# EAGLE design synthesizer-RF-Si4123 (EAGLE 9.2.2)
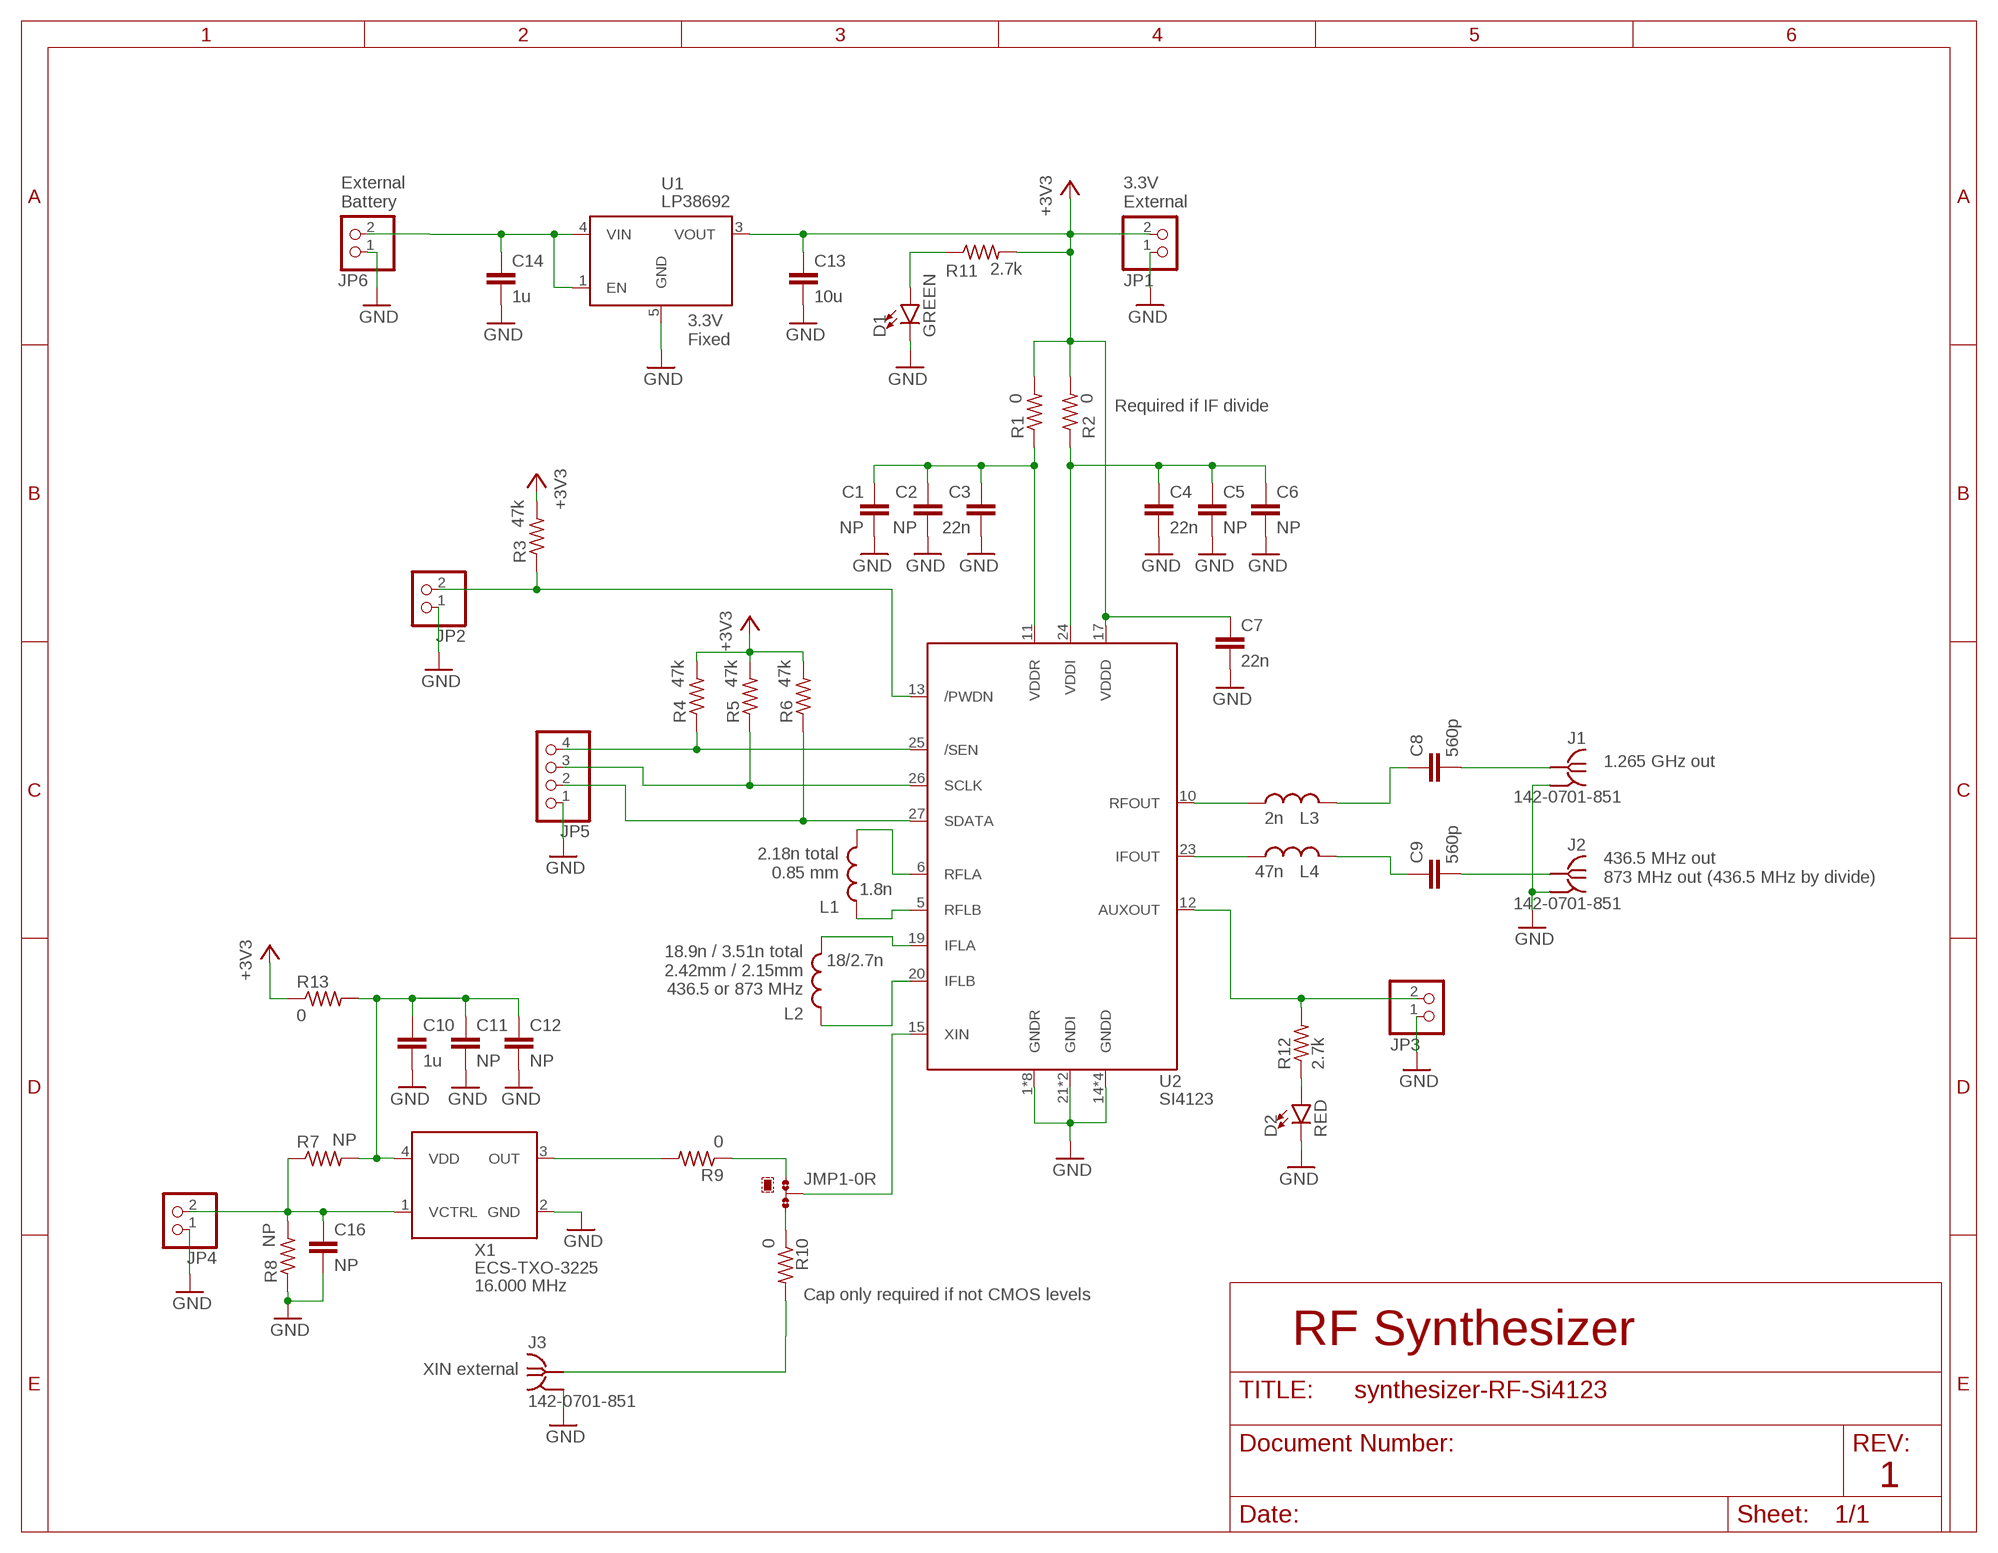
[diagram p0: schematic, sheet 1]

## Parts
C1  NP  C-EU0603-B-NOSILK  [.0603-B-NOSILK]
C2  NP  C-EU0603-B-NOSILK  [.0603-B-NOSILK]
C3  22n  C-EU0603-B-NOSILK  [.0603-B-NOSILK]
C4  22n  C-EU0603-B-NOSILK  [.0603-B-NOSILK]
C5  NP  C-EU0603-B-NOSILK  [.0603-B-NOSILK]
C6  NP  C-EU0603-B-NOSILK  [.0603-B-NOSILK]
C7  22n  C-EU0603-B-NOSILK  [.0603-B-NOSILK]
C8  560p  C-EU0402-B-NOSILK  [.0402-B-NOSILK]
C9  560p  C-EU0402-B-NOSILK  [.0402-B-NOSILK]
C10  1u  C-EU0603-B-NOSILK  [.0603-B-NOSILK]
C11  NP  C-EU0603-B-NOSILK  [.0603-B-NOSILK]
C12  NP  C-EU0603-B-NOSILK  [.0603-B-NOSILK]
C13  10u  C-EU0805-B-NOSILK  [.0805-B-NOSILK]
C14  1u  C-EU0603-B-NOSILK  [.0603-B-NOSILK]
C16  NP  C-EU0603-B-NOSILK  [.0603-B-NOSILK]
D1  GREEN  LED-GREEN0603  [LED-0603]
D2  RED  LED-GREEN0603  [LED-0603]
J1  142-0701-851  [142-0701-851]
J2  142-0701-851  [142-0701-851]
J3  142-0701-851  [142-0701-851]
JMP1  0R-JUMPA  [A0R-JMP]
JP1  PINHD-1X2  [1X02]
JP2  PINHD-1X2  [1X02]
JP3  PINHD-1X2  [1X02]
JP4  PINHD-1X2  [1X02]
JP5  PINHD-1X4  [1X04]
JP6  PINHD-1X2  [1X02]
L1  1.8n  L-US0402-C-NOSILK  [.0402-C-NOSILK]
L2  18/2.7n  L-US0402-C-NOSILK  [.0402-C-NOSILK]
L3  2n  L-US0402-B-NOSILK  [.0402-B-NOSILK]
L4  47n  L-US0402-B-NOSILK  [.0402-B-NOSILK]
R1  0  R-US_0603-B-NOSILK  [.0603-B-NOSILK]
R2  0  R-US_0603-B-NOSILK  [.0603-B-NOSILK]
R3  47k  R-US_0402-B-NOSILK  [.0402-B-NOSILK]
R4  47k  R-US_0402-B-NOSILK  [.0402-B-NOSILK]
R5  47k  R-US_0402-B-NOSILK  [.0402-B-NOSILK]
R6  47k  R-US_0402-B-NOSILK  [.0402-B-NOSILK]
R7  NP  R-US_0603-B-NOSILK  [.0603-B-NOSILK]
R8  NP  R-US_0603-B-NOSILK  [.0603-B-NOSILK]
R9  0  R-US_0402-B-NOSILK  [.0402-B-NOSILK]
R10  0  R-US_0402-B-NOSILK  [.0402-B-NOSILK]
R11  2.7k  R-US_0603-B-NOSILK  [.0603-B-NOSILK]
R12  2.7k  R-US_0603-B-NOSILK  [.0603-B-NOSILK]
R13  0  R-US_0603-B-NOSILK  [.0603-B-NOSILK]
U1  LP38692  [SOT223-5]
U2  SI4123  [QFN28-5X5-WITH-CENTER-PAD]
X1  ECS-TXO-3225  [3.2X2.5]

## Nets
+3V3: C7.1 C13.1 JP1.2 R1.2 R2.2 R3.2 R4.2 R5.2 R6.2 R11.2 R13.1 U1.3(VOUT) U2.17(VDDD)
+BAT: C14.1 JP6.2 U1.1(EN) U1.4(VIN)
GND: C1.2 C2.2 C3.2 C4.2 C5.2 C6.2 C7.2 C10.2 C11.2 C12.2 C13.2 C14.2 C16.2 D1.C D2.C J1.GND1(GND) J1.GND2(GND) J1.GND3(GND) J1.GND4(GND) J2.GND1(GND) J2.GND2(GND) J2.GND3(GND) J2.GND4(GND) J3.GND1(GND) J3.GND2(GND) J3.GND3(GND) J3.GND4(GND) JP1.1 JP2.1 JP3.1 JP4.1 JP5.1 JP6.1 R8.1 U1.5(GND) U2.1(GNDR) U2.2(GNDR) U2.3(GNDR) U2.4(GNDR) U2.7(GNDR) U2.8(GNDR) U2.9(GNDR) U2.14(GNDD) U2.16(GNDD) U2.18(GNDD) U2.21(GNDI) U2.22(GNDI) U2.28(GNDR) U2.PAD(GNDD) X1.2(GND)
IF_OUT [RF1]: C9.2 J2.RF1(RF)
N$1 [RF1]: JMP1.3 R10.1
N$2: L1.2 U2.6(RFLA)
N$3: L1.1 U2.5(RFLB)
N$4: JP2.2 R3.1 U2.13(/PWDN)
N$5: JP5.4 R4.1 U2.25(/SEN)
N$6: JP5.3 R5.1 U2.26(SCLK)
N$7: JP5.2 R6.1 U2.27(SDATA)
N$8: JP3.2 R12.2 U2.12(AUXOUT)
N$9 [RF1]: JMP1.1 R9.1
N$10: C10.1 C11.1 C12.1 R7.2 R13.2 X1.4(VDD)
N$11 [RF1]: C9.1 L4.2
N$13 [RF2]: L4.1 U2.23(IFOUT)
N$14 [RF1]: C8.1 L3.2
N$15: C1.1 C2.1 C3.1 R1.1 U2.11(VDDR)
N$17 [RF2]: JMP1.2 U2.15(XIN)
N$19: C16.1 JP4.2 R7.1 R8.2 X1.1(VCTRL)
N$20 [RF2]: R9.2 X1.3(OUT)
N$21: D1.A R11.1
N$22: D2.A R12.1
N$23: L2.2 U2.19(IFLA)
N$24: L2.1 U2.20(IFLB)
N$25 [RF2]: L3.1 U2.10(RFOUT)
N$93: C4.1 C5.1 C6.1 R2.1 U2.24(VDDI)
REF_IN [RF1]: J3.RF1(RF) R10.2
RF_OUT [RF1]: C8.2 J1.RF1(RF)

## Notes on the sheet
- External
  Battery
- 3.3V
  External
- 3.3V
  Fixed
- Required if IF divide
- 1.265 GHz out
- 2.18n total
  0.85 mm
- 436.5 MHz out
  873 MHz out (436.5 MHz by divide)
- 18.9n / 3.51n total
  2.42mm / 2.15mm
  436.5 or 873 MHz
- 16.000 MHz
- Cap only required if not CMOS levels
- RF Synthesizer
- XIN external
- 1

## Library data of the parts
C1-C14 C16 = oresat-rcl:C-EU: CAPACITOR, European symbol
D1 = SparkFun-LED:LED-GREEN: Green SMD LED Used in manufacturing of various products at SparkFun Packages: 0603 - SMD 0603 package [Product Link] <http://www.futureelectronics.com/en/technologies/semiconductors/optoelectronics/leds/Pages/9894312-LTST-C190GKT.aspx?CrossPart=HSMG-C190&IM=0> LilyPad 1206 - SMD1206 LilyPad package [Product Link] <http://www.futureelectronics.com/en/Technologies/Product.aspx?ProductID=IN150NGHARVATEKCORPORATION2049943&IM=0> 1206 - SMD1206 package [Product Link] <http://www.futureelectronics.com/en/technologies/semiconductors/optoelectronics/leds/Pages/8315665-LTST-C150KGKT.aspx?IM=0> 1206 Bottom Mount -SMD 1206 Bottom Mount [Product Link] <http://www.digikey.com/product-detail/en/lite-on-inc/LTST-C230KGKT/160-1456-1-ND/386854> SparkFun Products: Pro Mini 328 -5V <https://www.sparkfun.com/products/821> RedBoard <https://www.sparkfun.com/products/12757> MP3 Trigger <https://www.sparkfun.com/products/13720> Makey Makey <https://www.sparkfun.com/products/11076>
D2 = SparkFun-LED:LED-GREEN: Green SMD LED Used in manufacturing of various products at SparkFun Packages: 0603 - SMD 0603 package [Product Link] <http://www.futureelectronics.com/en/technologies/semiconductors/optoelectronics/leds/Pages/9894312-LTST-C190GKT.aspx?CrossPart=HSMG-C190&IM=0> LilyPad 1206 - SMD1206 LilyPad package [Product Link] <http://www.futureelectronics.com/en/Technologies/Product.aspx?ProductID=IN150NGHARVATEKCORPORATION2049943&IM=0> 1206 - SMD1206 package [Product Link] <http://www.futureelectronics.com/en/technologies/semiconductors/optoelectronics/leds/Pages/8315665-LTST-C150KGKT.aspx?IM=0> 1206 Bottom Mount -SMD 1206 Bottom Mount [Product Link] <http://www.digikey.com/product-detail/en/lite-on-inc/LTST-C230KGKT/160-1456-1-ND/386854> SparkFun Products: Pro Mini 328 -5V <https://www.sparkfun.com/products/821> RedBoard <https://www.sparkfun.com/products/12757> MP3 Trigger <https://www.sparkfun.com/products/13720> Makey Makey <https://www.sparkfun.com/products/11076>; VALUE: GREEN
J1-J3 = J-Cinch-142-0701-851-SMA-end-launch:142-0701-851: SMA Jack 50Ω - End Launch Source: Datasheet <https://belfuse.com/resources/productinformations/cinchconnectivitysolutions/johnson/pi-ccs-john-142-0701-851.pdf>
JMP1 = jump-0r-smd:0R-JUMP: SMD 0R 0805 Jumper
JP1-JP4 JP6 = pinhead:PINHD-1X2: PIN HEADER
JP5 = pinhead:PINHD-1X4: PIN HEADER
L1-L4 = oresat-rcl:L-US: INDUCTOR, American symbol
R1-R13 = oresat-rcl:R-US_: RESISTOR, American symbol
U1 = U-TI-LP38692-linear-reg:LP38692: 1A LDO Linear Regulator
U2 = U-Silicon-Labs-Si4133-synthesizer:SI4123: RF Synthesizer w/ integrated VCOs (RF1/IF OUT)
X1 = X-ECS-TXO-TCXO:ECS-TXO-3225: HCMOS TCXO Stability: 2.5ppm (-30 to +85 ℃) Source: Datasheet <https://ecsxtal.com/store/pdf/ECS-TXO-3225.pdf>

## Net classes
1 RF1: clearance 0.762 mm
2 RF2: clearance 0.203 mm

## Board
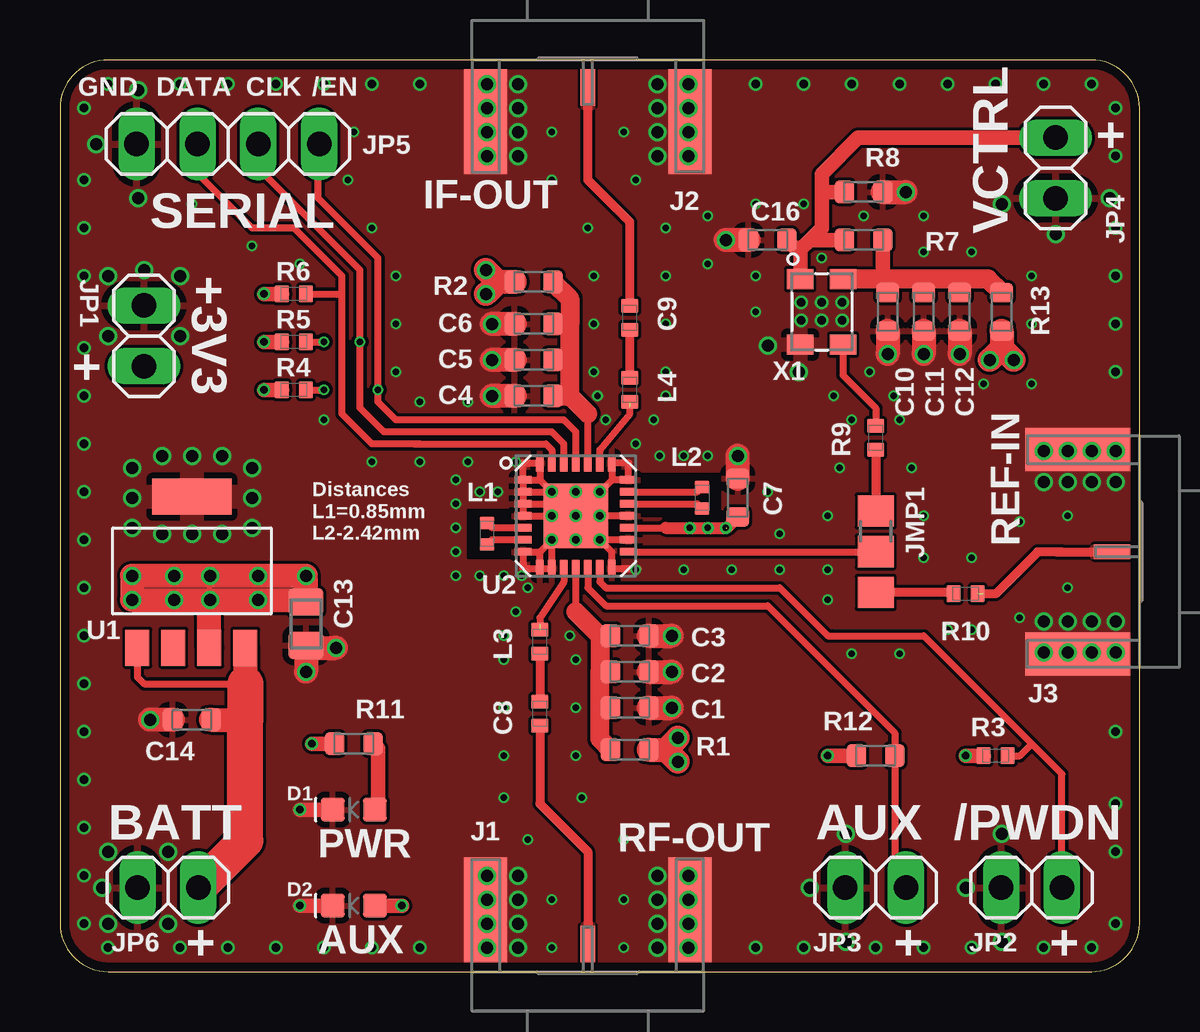
[diagram p1: board, top side]
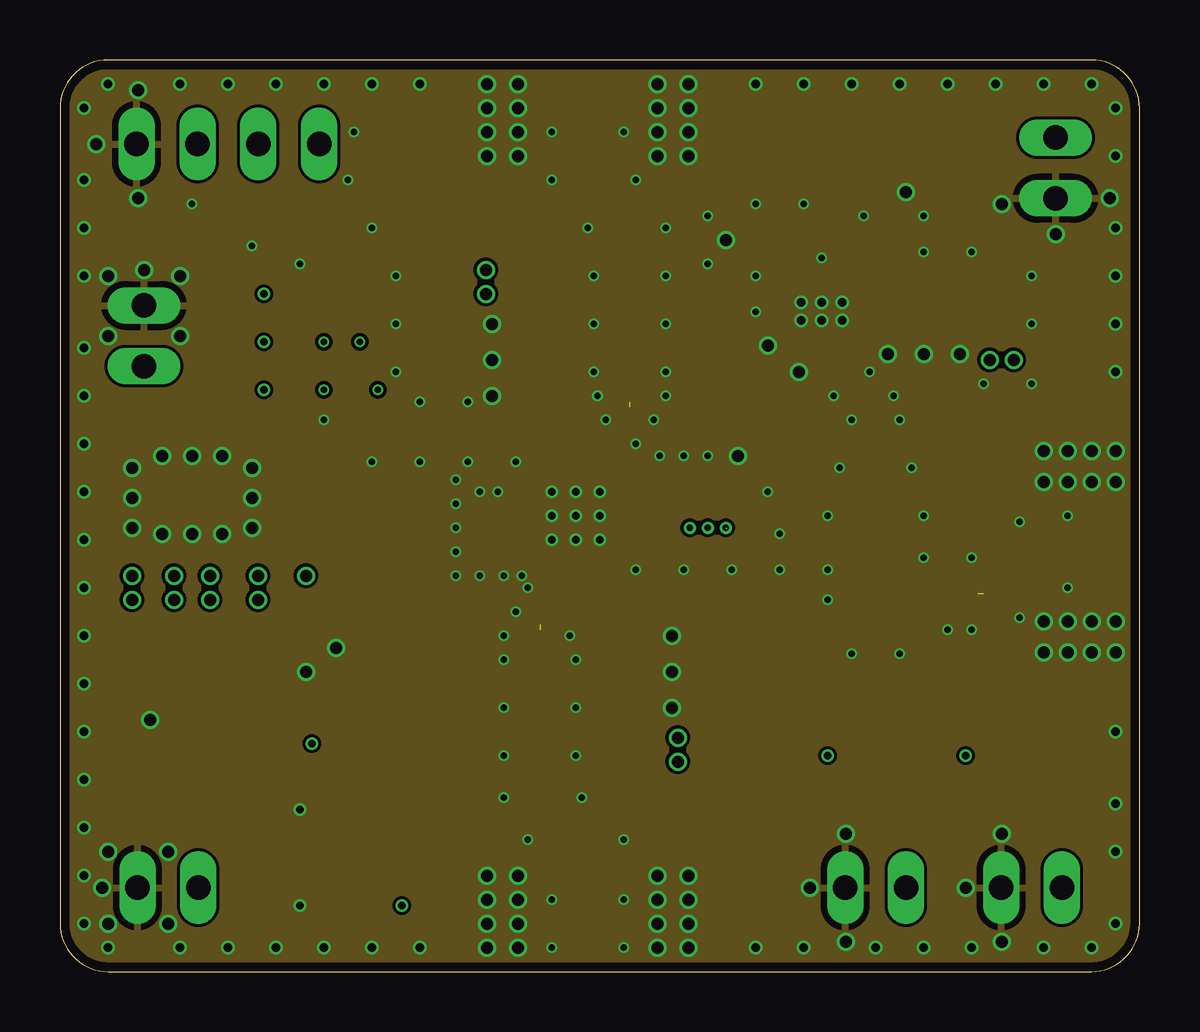
[diagram p2: board, inner layer Route2]
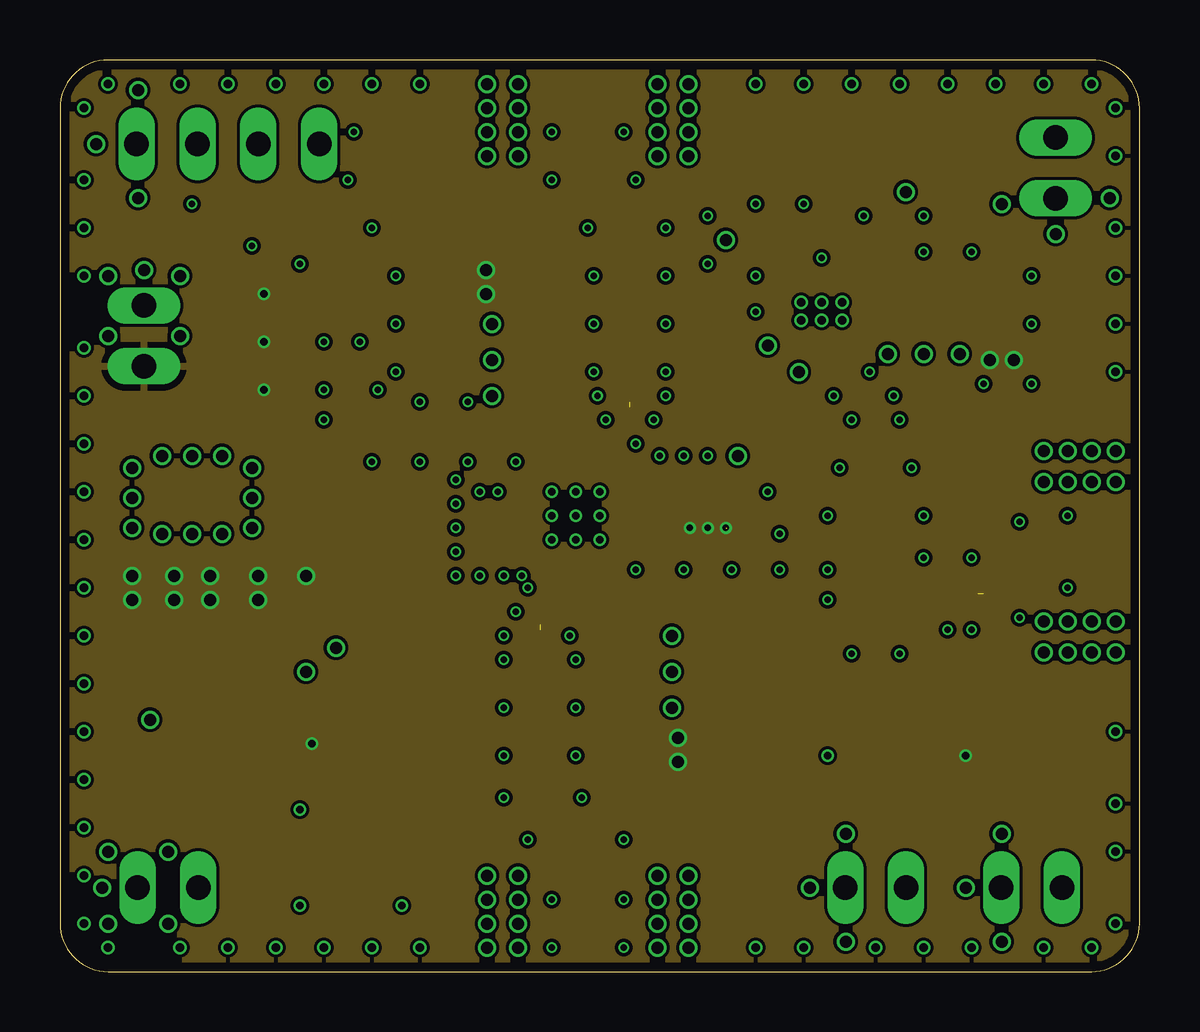
[diagram p3: board, inner layer Route15]
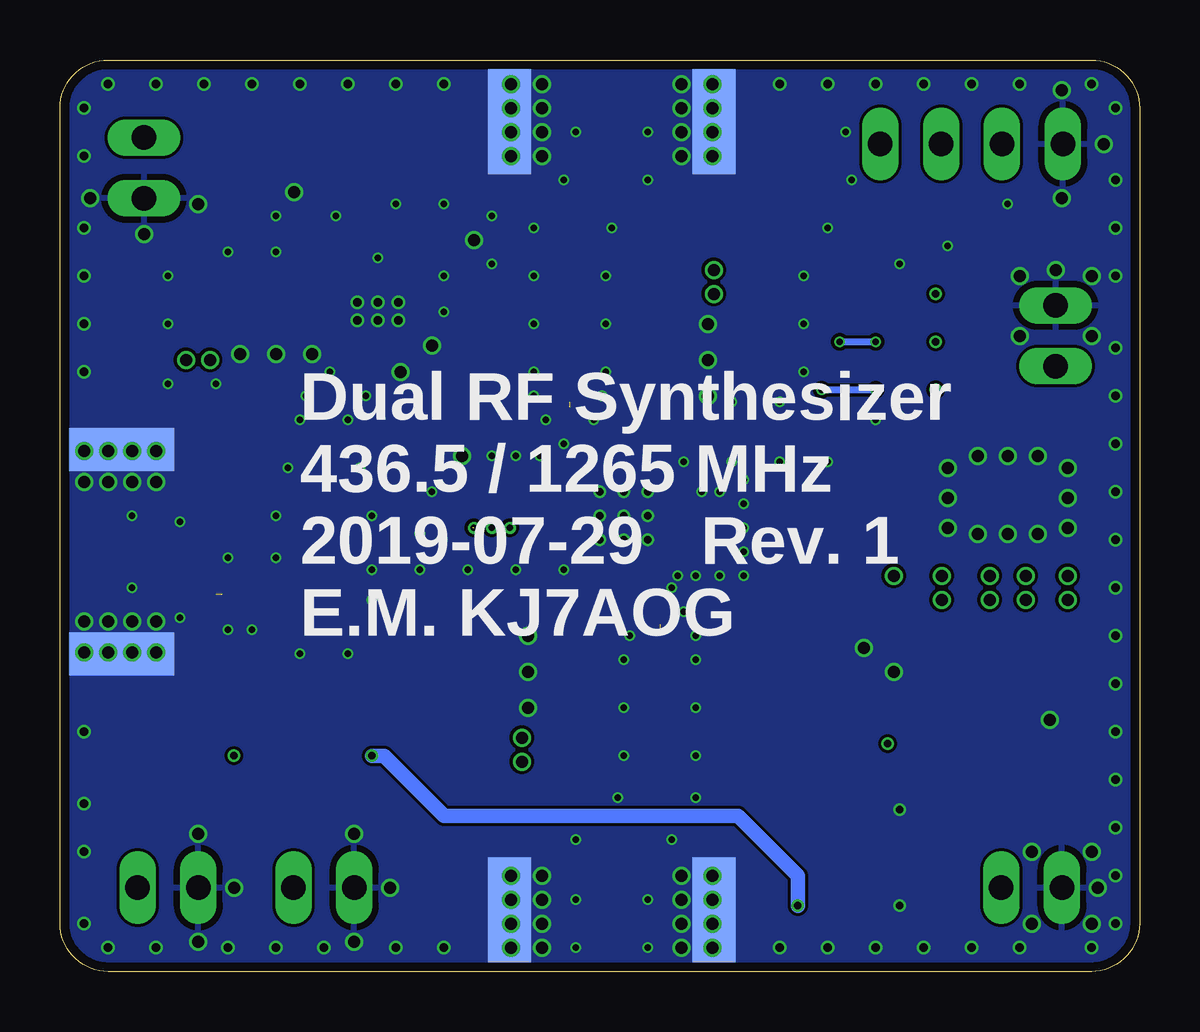
[diagram p4: board, bottom side, seen from below]

Size 45 x 38 mm. Coordinates in mm from the lower left corner, seen from the top.
Outline: 43,38 2,38 arc90 0,36 0,2 arc90 2,0 43,0 arc90 45,2 45,36 arc90 43,38
Copper layers (1*2*15*16): Top 0.035559375mm / dielectric 0.17018125mm / Route2 0.01778125mm / dielectric 47mil / Route15 0.01778125mm / dielectric 0.17018125mm / Bottom 0.035559375mm
Design rules "oshpark-4layer-tented": minimum track width 5mil, minimum drill 10mil, track to track 5mil, track to pad 5mil, pad to pad 5mil, via to via 5mil, smd to smd 5mil, copper to edge 15mil, drill to drill 6mil, minimum pad ring 4mil, minimum via ring 4mil, stop-mask expansion 2.5mil, vias tented up to drill 20mil, thermal gap 10mil

### Footprints (pad centres in the part's own frame; a part is rotated, then mirrored left to right if it is on the bottom)
.0603-B-NOSILK = smd 0.8 x 0.95: 1 -0.8,0; 2 0.8,0
.0402-B-NOSILK = smd 0.6 x 0.7: 1 -0.5,0; 2 0.5,0
.0805-B-NOSILK = smd 1.15 x 1.45: 1 -0.9,0; 2 0.9,0
LED-0603 = smd 1 x 1: A -0.877,0; C 0.877,0
142-0701-851 = smd 1.8 x 4.37: GND1 -4.255,-2.566; GND2 4.255,-2.566 | smd 1.8 x 4.37 bottom: GND3 -4.255,-2.566; GND4 4.255,-2.566 | smd 0.6 x 1.53: RF1 0,-1.146
A0R-JMP = smd 1.5 x 1.3: 1 0,1.7; 2 0,0; 3 0,-1.7
1X02 = drill 1.016 long: 1 -1.27,0; 2 1.27,0
1X04 = drill 1.016 long: 1 -3.81,0; 2 -1.27,0; 3 1.27,0; 4 3.81,0
.0402-C-NOSILK = smd 0.5 x 0.6: 1 -0.45,0; 2 0.45,0
SOT223-5 = smd 1 x 1.5: 1 -2.275,0; 2 -0.775,0; 3 0.725,0; 4 2.225,0 | smd 3.3 x 1.5: 5 0,6.3
QFN28-5X5-WITH-CENTER-PAD = smd 0.7 x 0.3: 1 -2.2,1.5; 2 -2.2,1; 3 -2.2,0.5; 4 -2.2,0; 5 -2.2,-0.5; 6 -2.2,-1; 7 -2.2,-1.5; 15 2.2,-1.5; 16 2.2,-1; 17 2.2,-0.5; 18 2.2,0; 19 2.2,0.5; 20 2.2,1; 21 2.2,1.5 | smd 0.3 x 0.7: 8 -1.5,-2.2; 9 -1,-2.2; 10 -0.5,-2.2; 11 0,-2.2; 12 0.5,-2.2; 13 1,-2.2; 14 1.5,-2.2; 22 1.5,2.2; 23 1,2.2; 24 0.5,2.2; 25 0,2.2; 26 -0.5,2.2; 27 -1,2.2; 28 -1.5,2.2 | smd 2.7 x 2.7: PAD 0,0
3.2X2.5 = smd 0.85 x 1.09: 1 -1.365,-0.895; 2 1.365,-0.895; 3 1.365,0.895; 4 -1.365,0.895

### Placement (x,y rotation side)
C1  23.75,11 0 top
C2  23.75,12.5 0 top
C3  23.75,14 0 top
C4  19.75,24 180 top
C5  19.75,25.5 180 top
C6  19.75,27 180 top
C7  28.25,19.75 90 top
C8  20,10.75 270 top
C9  23.75,27.25 90 top
C10  34.5,27.5 270 top
C11  36,27.5 270 top
C12  37.5,27.5 270 top
C13  10.25,14.5 270 top
C14  5.5,10.5 180 top
C16  29.5,30.5 180 top
D1  12.25,6.75 180 top
D2  12.25,2.75 180 top
J1  22,0 180 top
J2  22,38 0 top
J3  45,17.5 270 top
JMP1  34,17.5 0 top
JP1  3.5,26.5 270 top
JP2  40.5,3.5 0 top
JP3  34,3.5 0 top
JP4  41.5,33.5 90 top
JP5  7,34.5 0 top
JP6  4.5,3.5 0 top
L1  17.8,18.25 270 top
L2  26.77,19.75 270 top
L3  20,13.75 270 top
L4  23.75,24.25 90 top
R1  23.75,9.25 0 top
R2  19.75,28.75 180 top
R3  39,9 180 top
R4  9.75,24.25 180 top
R5  9.75,26.25 180 top
R6  9.75,28.25 180 top
R7  33.5,30.5 0 top
R8  33.5,32.5 180 top
R9  34,22.25 90 top
R10  37.75,15.75 0 top
R11  12.25,9.5 180 top
R12  34,9 0 top
R13  39.25,27.5 90 top
U1  5.5,13.5 0 top
U2  21.5,19 0 top
X1  31.75,27.5 270 top

### Tracks (layer width: path | path; a pad name or v marks a point on that pad's centre or on a via)
+3V3  (via drill 0.25 pad 0.5, 0.3, 0.5)  (1 unrouted)
  Top 0.3: U2.17 25.25,18.5
  Top 0.5: C7.1 27.8,18.5 25.25,18.5
  Top 0.6: R6.2 v8.5,28.25 | R5.2 v8.5,26.25 | R4.2 v8.5,24.25 | R3.2 v37.75,9 | v10.5,9.5 R11.2
  Top 1: C13.1 10.25,16.25 | 10.25,16.25 v10.25,16.5 v3,16.5 v3,15.5 v6.25,15.5 | v6.25,15.5 10.25,15.5 10.25,16.25 | U1.3 6.22,15.5 v6.25,15.5 | R13.1 39.25,26 | 39.25,26 v39.75,25.5 | v38.75,25.5 39.25,26 | 25.25,9.25 R1.2 25.25,9.25 | 25.25,9.25 v25.75,9.75 | 25.25,9.25 v25.75,8.75 | 18.25,28.75 R2.2 18.25,28.75 | 18.25,28.75 v17.75,29.25 | 18.25,28.75 v17.75,28.25
  other vias: 27.75,18.5 27,18.5 26.25,18.5 6.25,16.5 4.75,16.5 4.75,15.5 8.25,15.5 8.25,16.5
  pour Route15: 0,0 45,0 45,38 0,38
+BAT
  Top 0.3: U1.1 3.23,12.28 3.5,12 7.72,12
  Top 1: U1.4 7.72,12 | C14.1 7.72,10.5
  Top 1.5: 7.72,12 7.72,10.5 7.72,5.46 JP6.2
GND  (via drill 0.25, 0.3, 0.3 pad 0.5, 0.35, 0.35 pad 0.5, 0.5, 0.5 pad 0.5)
  Top 0.3: U2.21 23.56,20.5 | U2.16 v22.5,18 23,17.5 U2.14 24.1,16.8 | U2.18 v22.5,19 | U2.21 23,20.5 | 23,20.5 v22.5,20 | 23,20.5 U2.22 23.7,21.2 U2.21 | U2.2 20.25,20 | 20.25,20 v20.5,20 | U2.1 20,20.5 | 20,20.5 20.25,20.25 20.25,20 | 20,20.5 U2.28 19.3,21.2 U2.1 | v20.5,19 U2.4 U2.1 | 20,17.5 U2.7 19.3,16.8 U2.8 | 20,17.5 v20.5,18 U2.9 U2.8 | U2.8 20,17.5 | U2.3 21,19.5 U2.PAD
  Top 0.6: D1.C v10,6.75 | D2.C v10,2.75
  Top 1: C14.2 v3.75,10.5 | v10.25,12.5 C13.2 10.25,13.5 v11.5,13.5 | C6.2 v18,27 | C5.2 v18,25.5 | C4.2 v18,24 | C10.2 v34.5,25.75 | C11.2 v36,25.75 | C12.2 v37.5,25.75 | C3.2 v25.5,14 | C2.2 v25.5,12.5 | C1.2 v25.5,11 | C7.2 v28.25,21.5 | R8.1 v35.25,32.5 | C16.2 v27.75,30.5
  other vias: 21.5,19 21.5,20 21.5,18 30.9,27.9 31.75,27.9 30.9,27.15 31.75,27.15 32.6,27.15 32.6,27.9 19,21.25 17,21.25 15,21.25 18.25,20 16.5,18.5 18.5,16.5 16.5,16.5 17.5,16.5 16.5,17.5 16.5,19.5 16.5,20.5 17.5,20 19.25,16.5 24,22 25,21.5 26,21.5 27,21.5 24,16.75 28,16.75 26,16.75 30,16.75 32,16.75 32,15.5 30,18.25 33,23 33.75,25 35,23 34.75,24 32.25,24 18.5,14 19,15 19.5,16 21.25,14 24.75,23 25.25,24 22.75,23 22.4,24 22.25,25 25.25,25 18.5,13 21.5,13 29.5,20 37,14.25 42,16 40,14.75 38,14.25 43,14.6 42,14.6 41,14.6 41,13.3 42,13.3 43,13.3 42,20.4 43,20.4 44,20.4 44,21.7 43,21.7 41,20.4 42,19 40,18.75 38,17.25 36,17.25 36,19 35.5,21 32.5,21 32,19 24.9,2 24.9,3 24.9,4 26.2,4 26.2,3 26.2,2 19.1,3 19.1,2 19.1,1 17.8,3 17.8,4 19.1,4 24.9,37 24.9,36 24.9,35 26.2,35 26.2,36 26.2,37 19.1,37 19.1,36 19.1,35 17.8,35 17.8,36 17.8,37 20.5,35 23.5,35 24,33 25.25,31 25.25,29 25.25,27 22.25,27 22.25,29 22,31 20.5,33 20.5,1 23.5,1 23.5,3 20.5,3 23.5,5.5 21.75,7.25 21.5,9 19.5,5.5 18.5,7.25 18.5,9 18.5,11 21.5,11 31,32 29,32 27,31.5 27,29.5 29,29 33.5,31.5 31.75,29.75 36,31.5 36,30 38,30 40.5,29 40.5,27 40.5,24.5 38.5,24.5 30.8,25 29.5,26.1 29,27.5 39.25,32 41.5,30.75 43.75,32.25 3.25,36.75 1.5,34.5 3.25,32.25 3.5,29.25 5,29 2,29 8,19.75 5.5,21.5 5.5,18.25 3,19.75 3,21 4.25,21.5 6.75,21.5 8,21 4.25,18.25 6.75,18.25 8,18.5 3,18.5 4.5,5 4.5,2 1.75,3.5 31.25,3.5 32.75,5.75 32.75,1.25 39.25,5.75 39.25,1.25 37.75,3.5 44,10 44,7 44,5 44,2 29,1 31,1 34,1 36,1 38,1 15,1 13,1 11,1 9,1 7,1 5,1 1,2 1,4 1,6 1,8 1,10 1,12 1,14 1,16 1,18 1,20 1,22 1,24 1,26 1,36 1,33 1,29 1,31 15,37 13,37 11,37 9,37 7,37 5,37 29,37 31,37 33,37 35,37 37,37 39,37 41,37 44,25 44,27 44,29 44,31 44,34 44,36 43,37 2,37 2,1 43,1 41,1 13,21.25 11,23 15,23.75 17,23.75 14,25 14,27 14,29 13,31 12,33 12.25,35 10,29.5 5.5,32 8,30.25 33,13.25 35,13.25 5,26.5 2,26.5 2,5 2,2 17.8,34 19.1,34 24.9,34 26.2,34 44,14.6 44,13.3 41,21.7 42,21.7 24.9,1 26.2,1 17.8,2 17.8,1
  pour Bottom: 0,0 45,0 45,38 0,38
  pour Route2: 0,0 45,0 45,38 0,38
  pour Top: 3,21.5 8,21.5 8,18 3,18
  pour Top: 29.5,29 33,29 33,25 29.5,25
  pour Top: 0,0 45,0 45,38 0,38
  pour Top: 0.75,5.75 7.75,5.75 7.75,0.75 0.75,0.75
  pour Top: 30,5.75 44,5.75 44,1 30,1
  pour Top (no thermals): 16,0 28,0 28,5.5 16,5.5
  pour Top (no thermals): 45,23.5 39.5,23.5 39.5,11.5 45,11.5
  pour Top (no thermals): 16,38 16,32.5 28,32.5 28,38
  pour Top: 43.75,36.75 43.75,30 39,30 39,36.75
  pour Top: 1.25,37 1.25,23.25 5.75,23.25 5.75,37
  cutout Top: 24.25,20.75 27.5,20.75 27.5,19 24.25,19
  cutout Top: 17,19.25 18.75,19.25 18.75,17.25 17,17.25
  pour Bottom (no thermals): 16,0 28,0 28,5.5 16,5.5
  pour Bottom (no thermals): 45,11.5 45,23.5 39.5,23.5 39.5,11.5
  pour Bottom (no thermals): 16,32.5 28,32.5 28,38 16,38
  cutout Top (no thermals): 21,20.75 21,20.25 22,20.25 22,20.75
  cutout Top (no thermals): 21,17.75 21,17.25 22,17.25 22,17.75
IF_OUT
  Top 0.37: C9.2 23.75,31.25 22,33 J2.RF1
  pour Top (no thermals): 21.75,36.25 21.75,36 22,35.75 22.25,36 22.25,36.25
N$1
  Top 0.34: R10.1 37.2,15.8
  Top 0.37: 37.2,15.8 JMP1.3
N$2
  Top 0.3: U2.6 18,18 L1.2
N$3
  Top 0.3: U2.5 18,18.5 L1.1
N$4
  Top 0.3: U2.13 22.5,16.25 22.75,16 30,16 32,14 36,14 40.5,9.5 | JP2.2 41.77,8.23 40.5,9.5 | R3.1 40,9 40.5,9.5
N$5  (via drill 0.25)
  Top 0.3: U2.25 21.5,22.5 21,23 14,23 13.25,23.75 v13.25,24.25 13.25,29.75 10.75,32.25 10.75,34.44 JP5.4 | R4.1 v11,24.25
  Bottom 0.3: v11,24.25 v13.25,24.25
N$6  (via drill 0.25)
  Top 0.3: U2.26 21,22 20.5,22.5 13.5,22.5 12.5,23.5 v12.5,26.25 12.5,29.25 8.27,33.48 JP5.3 | R5.1 v11,26.25
  Bottom 0.3: v11,26.25 v12.5,26.25
N$7
  Top 0.3: U2.27 20.5,21.75 20.25,22 15,22 | 14.75,22 15,22 | 15,22 13,22 11.75,23.25 11.75,28.25 | 11.75,28.25 11.75,29 9.75,31 8,31 5.73,33.27 JP5.2 | R6.1 11.75,28.25
N$8
  Top 0.3: U2.12 22,16 22.75,15.25 29.5,15.25 34.8,9.95 R12.2 34.8,3.97 JP3.2
N$9
  Top 0.37: R9.1 JMP1.1
N$10
  Top 0.6: R7.2 34.3,29.07 34.5,28.86
  Top 0.8: 37.5,28.86 36,28.86 | 36,28.86 34.5,28.86 | 34.5,28.86 X1.4 | C10.1 34.5,28.86 | C11.1 36,28.86 | C12.1 37.5,28.86 | R13.2 38.69,28.86 37.5,28.86
N$11
  Top 0.37: L4.2 C9.1
N$13  (1 unrouted)
  Top 0.3: U2.23 22.5,21.75 23.75,23.25 23.75,23.54
N$14
  Top 0.37: L3.2 C8.1
N$15
  Top 0.3: 21.5,15 U2.11
  Top 0.6: C3.1 22.5,14 | C2.1 22.5,12.5
  Top 0.8: 21.5,15 22.5,14 22.5,12.5 22.5,11 | R1.1 22.5,9.7 22.5,11 | C1.1 22.5,11
N$17
  Top 0.3: U2.15 JMP1.2
N$19
  Top 0.6: C16.1 30.86,29.95 X1.1 30.86,30.11 31.25,30.5 | 31.25,30.5 R7.1 | R8.2 31.75,32.5 | 31.75,32.5 31.75,31 31.25,30.5 | JP4.2 33.27,34.77 31.75,33.25 31.75,32.5
N$20
  Top 0.3: X1.3 32.65,24.86 34,23.5 R9.2
N$21
  Top 0.6: D1.A 13.25,6.87 13.25,9.3 R11.1
N$22  (via drill 0.3, 0.3 pad 0.5)
  Top 0.6: R12.1 v32,9 | v14.25,2.75 D2.A
  Bottom 0.6: v32,9 31.5,9 29,6.5 16.75,6.5 14.25,4 v14.25,2.75
N$23
  Top 0.3: U2.19 26.57,19.5 L2.2
N$24
  Top 0.3: U2.20 26.57,20 L2.1
N$25  (1 unrouted)
  Top 0.3: U2.10 21,16.25 20,14.75 20,14.46
N$93
  Top 0.3: U2.24 22,23.25
  Top 0.6: C6.1 21.25,27 | C5.1 21.25,25.5
  Top 0.8: 21.25,24 21.25,25.5 21.25,27 21.25,28.05 R2.1 | C4.1 21.25,24 | 21.25,24 22,23.25
REF_IN  (1 unrouted)
  Top 0.37: 41.5,17.5 41.75,17.5 | 41.75,17.5 J3.RF1 | 41.75,17.5 40.75,17.5 39,15.75 38.5,15.75
  pour Top (no thermals): 43.25,17.75 43,17.75 42.75,17.5 43,17.25 43.25,17.25
RF_OUT
  Top 0.37: C8.2 20,7 22,5 J1.RF1
  pour Top (no thermals): 21.75,1.75 22.25,1.75 22.25,2 22,2.25 21.75,2

### Text on the board
tPlace: GND | DATA | CLK | /EN | + | IF-OUT | SERIAL | VCTRL | +3V3 | + | Distances / L1=0.85mm / L2-2.42mm | REF-IN | BATT | AUX | /PWDN | PWR | RF-OUT | AUX | + | + | +
bPlace: Dual RF Synthesizer / 436.5 / 1265 MHz / 2019-07-29 Rev. 1 / E.M. KJ7AOG